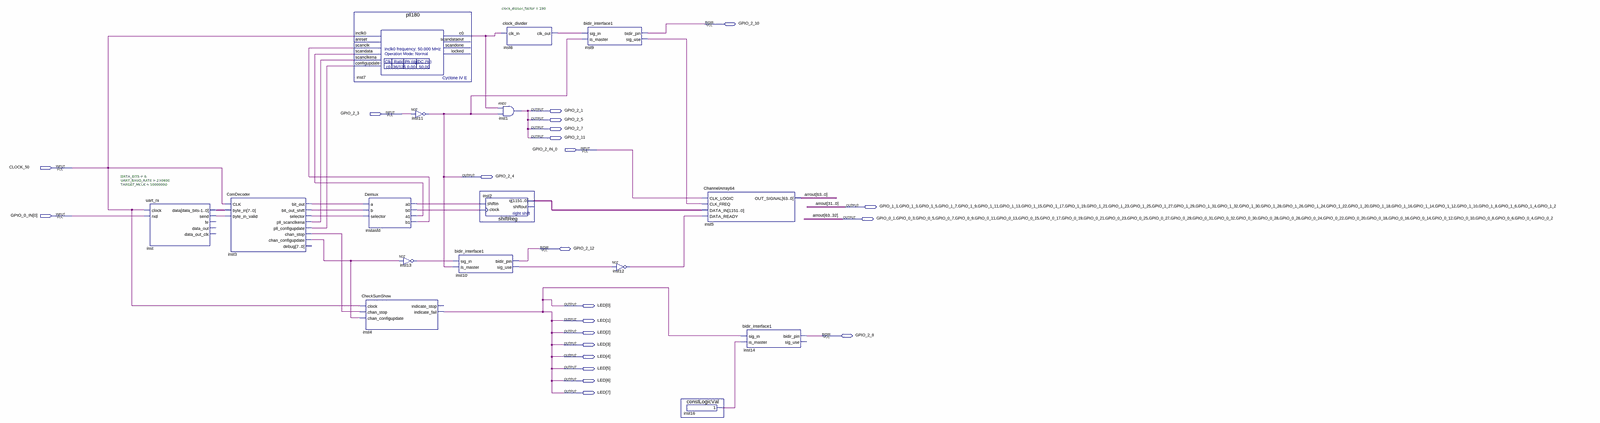
[diagram p0: schematic sheet, whole]
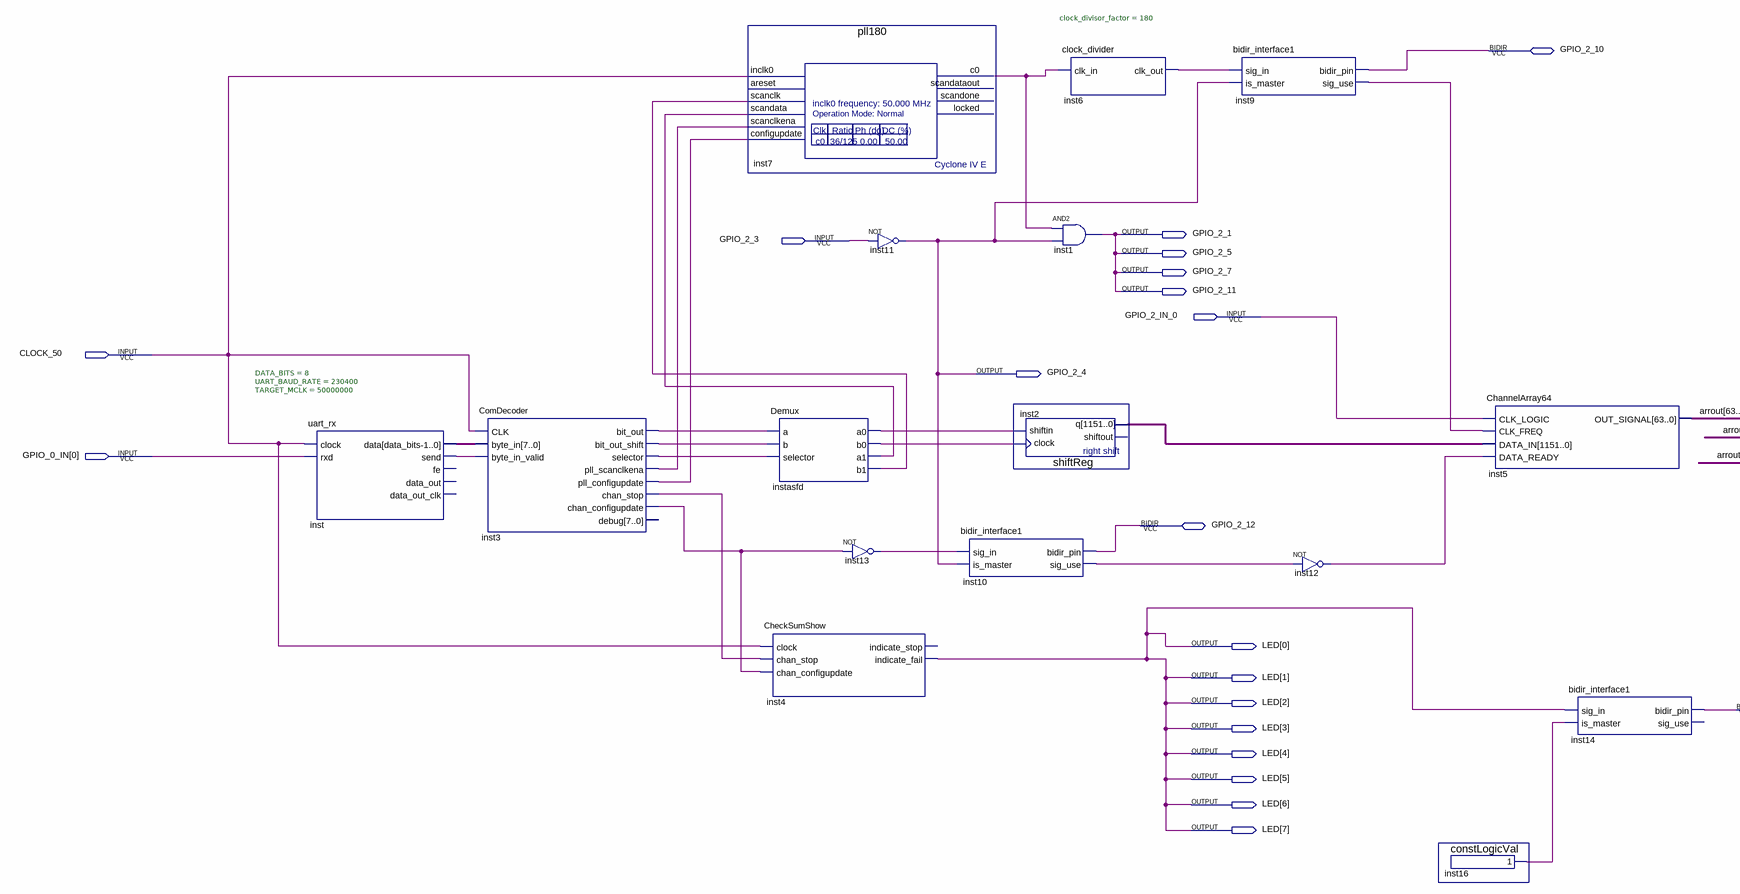
[diagram p1: schematic sheet, left part]
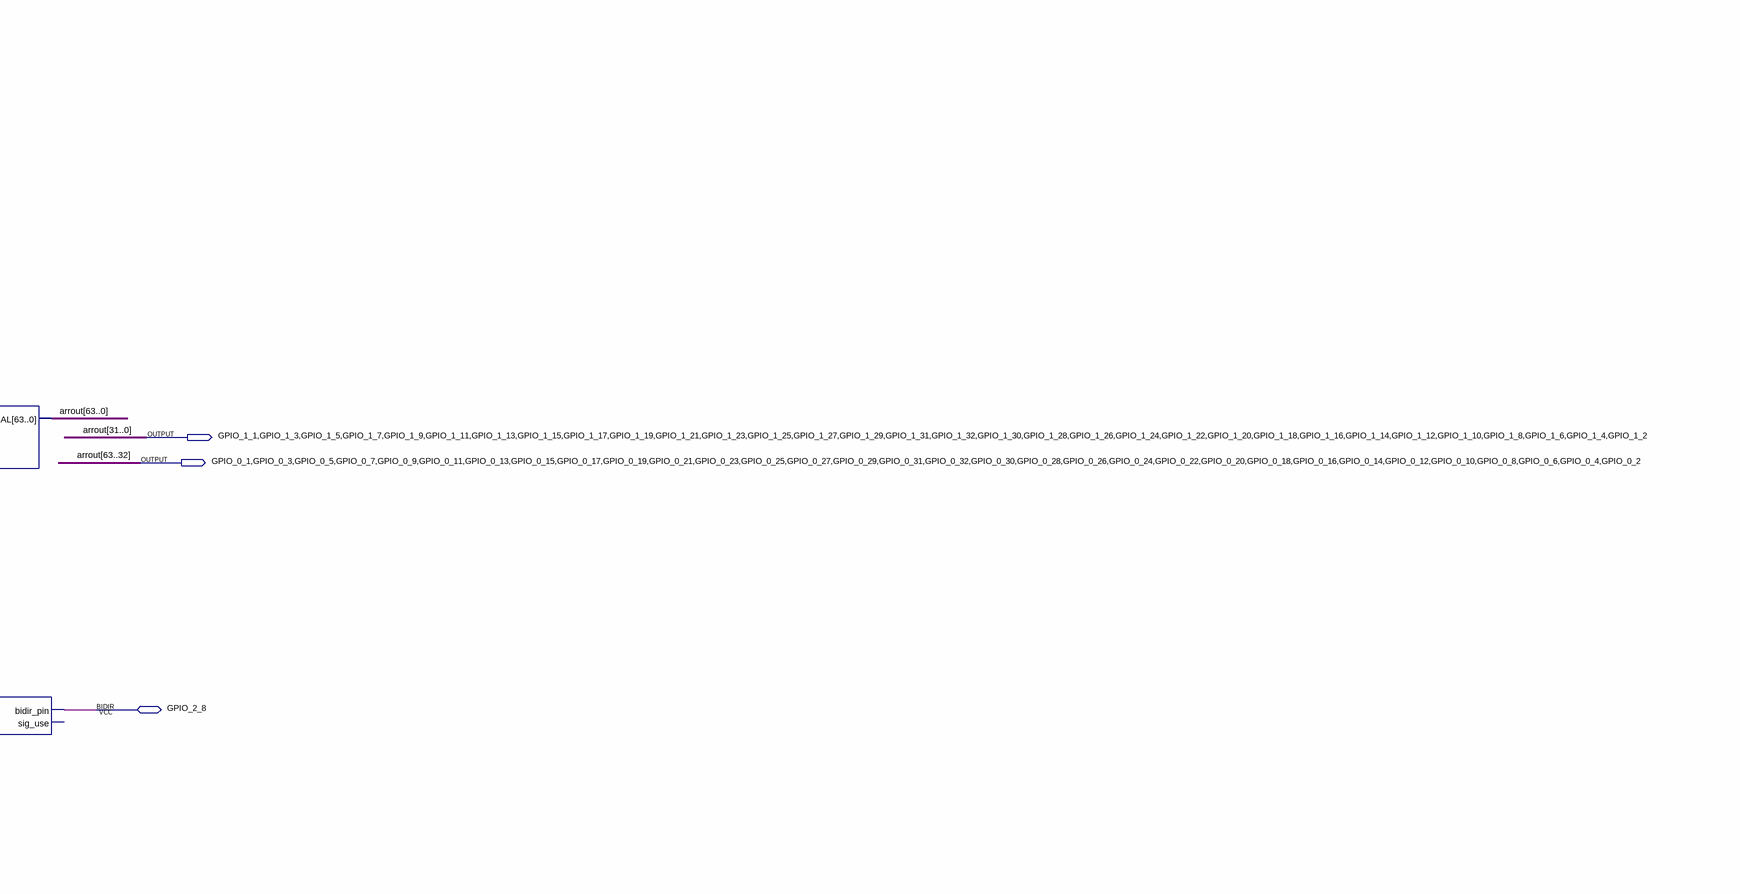
[diagram p2: schematic sheet, right part]
// Quartus schematic ShiftedSignalGenerator.bdf as structural Verilog: 16 symbols, 22 pins
module ShiftedSignalGenerator (
  input  GPIO_2_3,
  input  GPIO_2_IN_0,
  input  CLOCK_50,
  input  [0:0] GPIO_0_IN,
  inout  GPIO_2_10,
  inout  GPIO_2_12,
  inout  GPIO_2_8,
  output GPIO_2_1,
  output GPIO_2_5,
  output GPIO_2_7,
  output GPIO_2_11,
  output GPIO_2_4,
  output GPIO_1_1,
  output GPIO_1_3,
  output GPIO_1_5,
  output GPIO_1_7,
  output GPIO_1_9,
  output GPIO_1_11,
  output GPIO_1_13,
  output GPIO_1_15,
  output GPIO_1_17,
  output GPIO_1_19,
  output GPIO_1_21,
  output GPIO_1_23,
  output GPIO_1_25,
  output GPIO_1_27,
  output GPIO_1_29,
  output GPIO_1_31,
  output GPIO_1_32,
  output GPIO_1_30,
  output GPIO_1_28,
  output GPIO_1_26,
  output GPIO_1_24,
  output GPIO_1_22,
  output GPIO_1_20,
  output GPIO_1_18,
  output GPIO_1_16,
  output GPIO_1_14,
  output GPIO_1_12,
  output GPIO_1_10,
  output GPIO_1_8,
  output GPIO_1_6,
  output GPIO_1_4,
  output GPIO_1_2,
  output GPIO_0_1,
  output GPIO_0_3,
  output GPIO_0_5,
  output GPIO_0_7,
  output GPIO_0_9,
  output GPIO_0_11,
  output GPIO_0_13,
  output GPIO_0_15,
  output GPIO_0_17,
  output GPIO_0_19,
  output GPIO_0_21,
  output GPIO_0_23,
  output GPIO_0_25,
  output GPIO_0_27,
  output GPIO_0_29,
  output GPIO_0_31,
  output GPIO_0_32,
  output GPIO_0_30,
  output GPIO_0_28,
  output GPIO_0_26,
  output GPIO_0_24,
  output GPIO_0_22,
  output GPIO_0_20,
  output GPIO_0_18,
  output GPIO_0_16,
  output GPIO_0_14,
  output GPIO_0_12,
  output GPIO_0_10,
  output GPIO_0_8,
  output GPIO_0_6,
  output GPIO_0_4,
  output GPIO_0_2,
  output [7:0] LED
);

  wire inst3_bit_out, inst3_bit_out_shift, inst3_chan_configupdate, inst3_chan_stop, inst3_pll_configupdate,
       inst3_pll_scanclkena, inst3_selector, inst6_clk_out, inst7_c0, inst9_sig_use, inst10_sig_use,
       inst12_out, inst13_out, inst16_result, inst_send, instasfd_a0, instasfd_a1, instasfd_b0, instasfd_b1;
  wire [7:0] inst_data;
  wire [1151:0] inst2_q;

  uart_rx #(.DATA_BITS(8), .UART_BAUD_RATE(230400), .TARGET_MCLK(50000000)) inst (
    .clock(CLOCK_50), .rxd(GPIO_0_IN[0]), .data(inst_data), .send(inst_send));  // open: fe, data_out, data_out_clk
  ComDecoder inst3 (
    .CLK(CLOCK_50), .byte_in(inst_data), .byte_in_valid(inst_send), .bit_out(inst3_bit_out),
    .bit_out_shift(inst3_bit_out_shift), .selector(inst3_selector), .pll_scanclkena(inst3_pll_scanclkena),
    .pll_configupdate(inst3_pll_configupdate), .chan_stop(inst3_chan_stop),
    .chan_configupdate(inst3_chan_configupdate));  // open: debug
  pll180 inst7 (
    .inclk0(CLOCK_50), .scanclk(instasfd_b1), .scandata(instasfd_a1), .scanclkena(inst3_pll_scanclkena),
    .configupdate(inst3_pll_configupdate), .c0(inst7_c0));  // open: areset, scandataout, scandone, locked
  Demux instasfd (
    .a(inst3_bit_out), .b(inst3_bit_out_shift), .selector(inst3_selector), .a0(instasfd_a0),
    .b0(instasfd_b0), .a1(instasfd_a1), .b1(instasfd_b1));
  CheckSumShow inst4 (
    .clock(CLOCK_50), .chan_stop(inst3_chan_stop), .chan_configupdate(inst3_chan_configupdate),
    .indicate_fail(LED[7]));  // open: indicate_stop
  not inst11 (GPIO_2_4, GPIO_2_3);
  not inst13 (inst13_out, inst3_chan_configupdate);
  bidir_interface1 inst10 (.sig_in(inst13_out), .is_master(GPIO_2_4), .sig_use(inst10_sig_use), .bidir_pin(GPIO_2_12));
  shiftReg inst2 (.clock(instasfd_b0), .shiftin(instasfd_a0), .q(inst2_q));  // open: shiftout
  clock_divider #(.clock_divisor_factor(180)) inst6 (.clk_in(inst7_c0), .clk_out(inst6_clk_out));
  and inst1 (GPIO_2_1, inst7_c0, GPIO_2_4);
  bidir_interface1 inst9 (.sig_in(inst6_clk_out), .is_master(GPIO_2_4), .sig_use(inst9_sig_use), .bidir_pin(GPIO_2_10));
  not inst12 (inst12_out, inst10_sig_use);
  constLogicVal inst16 (.result(inst16_result));
  ChannelArray64 inst5 (
    .CLK_LOGIC(GPIO_2_IN_0), .CLK_FREQ(inst9_sig_use), .DATA_IN(inst2_q), .DATA_READY(inst12_out),
    .OUT_SIGNAL({GPIO_0_1, GPIO_0_3, GPIO_0_5, GPIO_0_7, GPIO_0_9, GPIO_0_11, GPIO_0_13, GPIO_0_15, GPIO_0_17, GPIO_0_19, GPIO_0_21, GPIO_0_23, GPIO_0_25, GPIO_0_27, GPIO_0_29, GPIO_0_31, GPIO_0_32, GPIO_0_30, GPIO_0_28, GPIO_0_26, GPIO_0_24, GPIO_0_22, GPIO_0_20, GPIO_0_18, GPIO_0_16, GPIO_0_14, GPIO_0_12, GPIO_0_10, GPIO_0_8, GPIO_0_6, GPIO_0_4, GPIO_0_2, GPIO_1_1, GPIO_1_3, GPIO_1_5, GPIO_1_7, GPIO_1_9, GPIO_1_11, GPIO_1_13, GPIO_1_15, GPIO_1_17, GPIO_1_19, GPIO_1_21, GPIO_1_23, GPIO_1_25, GPIO_1_27, GPIO_1_29, GPIO_1_31, GPIO_1_32, GPIO_1_30, GPIO_1_28, GPIO_1_26, GPIO_1_24, GPIO_1_22, GPIO_1_20, GPIO_1_18, GPIO_1_16, GPIO_1_14, GPIO_1_12, GPIO_1_10, GPIO_1_8, GPIO_1_6, GPIO_1_4, GPIO_1_2}));
  bidir_interface1 inst14 (.sig_in(LED[7]), .is_master(inst16_result), .bidir_pin(GPIO_2_8));  // open: sig_use

  assign GPIO_2_5 = GPIO_2_1;
  assign GPIO_2_7 = GPIO_2_1;
  assign GPIO_2_11 = GPIO_2_1;
  assign LED[6:0] = {7{LED[7]}};

  // Other names for the same wires on the sheet: arrout[63:0] = {GPIO_0_1, GPIO_0_3, GPIO_0_5, GPIO_0_7, GPIO_0_9, GPIO_0_11, GPIO_0_13, GPIO_0_15, GPIO_0_17, GPIO_0_19, GPIO_0_21, GPIO_0_23, GPIO_0_25, GPIO_0_27, GPIO_0_29, GPIO_0_31, GPIO_0_32, GPIO_0_30, GPIO_0_28, GPIO_0_26, GPIO_0_24, GPIO_0_22, GPIO_0_20, GPIO_0_18, GPIO_0_16, GPIO_0_14, GPIO_0_12, GPIO_0_10, GPIO_0_8, GPIO_0_6, GPIO_0_4, GPIO_0_2, GPIO_1_1, GPIO_1_3, GPIO_1_5, GPIO_1_7, GPIO_1_9, GPIO_1_11, GPIO_1_13, GPIO_1_15, GPIO_1_17, GPIO_1_19, GPIO_1_21, GPIO_1_23, GPIO_1_25, GPIO_1_27, GPIO_1_29, GPIO_1_31, GPIO_1_32, GPIO_1_30, GPIO_1_28, GPIO_1_26, GPIO_1_24, GPIO_1_22, GPIO_1_20, GPIO_1_18, GPIO_1_16, GPIO_1_14, GPIO_1_12, GPIO_1_10, GPIO_1_8, GPIO_1_6, GPIO_1_4, GPIO_1_2}
endmodule
